# Altium project 400W_Multiinput_Converter.PrjPCB
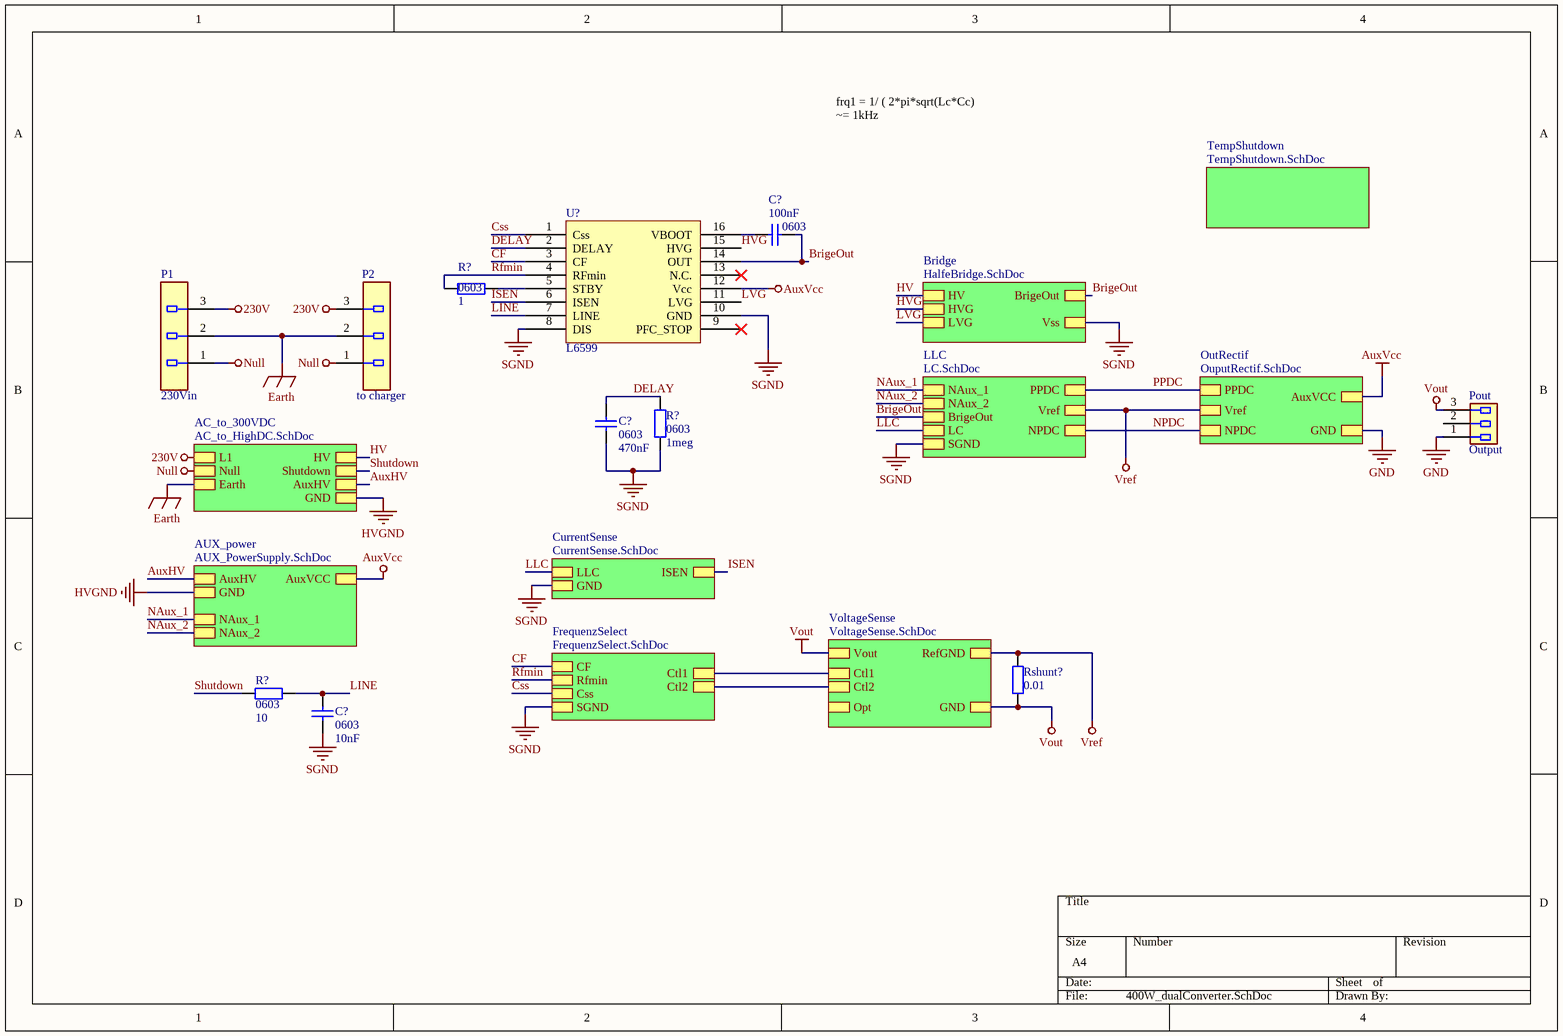
[diagram p0: 400W_dualConverter.SchDoc]
9 sheets, 95 parts. Net scope: hierarchical (ports join the sheet entries above them; power ports are global).
Sheets:
  400W_dualConverter.SchDoc
    AC_to_300VDC = AC_to_HighDC.SchDoc
    AUX_power = AUX_PowerSupply.SchDoc
    CurrentSense = CurrentSense.SchDoc
    OutRectif = OuputRectif.SchDoc
    TempShutdown = TempShutdown.SchDoc
    FrequenzSelect = FrequenzSelect.SchDoc
    VoltageSense = VoltageSense.SchDoc
    LLC = LC.SchDoc

## Sheet 400W_dualConverter.SchDoc
size A4

### Parts
(Parts that share a designator on the sheet are numbered #1, #2 ... from top to bottom, then left to right.)
C?#1  0603  value 100nF  [1608[0603]]
C?#2  0603  value 470nF  [1608[0603]]
C?#3  0603  value 10nF  [1608[0603]]
P1  230Vin  [IEC C14]
P2  to charger  [IEC C13 FM]
Pout  Output  [3pin, 5.08 terminal connector]
R?#1  0603  value 1  [1608[0603]]
R?#2  0603  value 1meg  [1608[0603]]
R?#3  0603  value 10  [1608[0603]]
Rshunt?  value 0.01  [1608[0603]]  (hidden comment: Res2)
U?#1  L6599  [SOP127P600X175-16N]

### Sub-sheets
AC_to_300VDC = AC_to_HighDC.SchDoc: L1, Null, Shutdown, HV, Earth, AuxHV, GND
AUX_power = AUX_PowerSupply.SchDoc: AuxHV, GND, NAux_1, NAux_2, AuxVCC
Bridge = HalfeBridge.SchDoc (file not in this document): HV, HVG, LVG, Vss, BrigeOut
CurrentSense = CurrentSense.SchDoc: LLC, GND, ISEN
FrequenzSelect = FrequenzSelect.SchDoc: CF, Rfmin, SGND, Ctl1, Ctl2, Css
LLC = LC.SchDoc: BrigeOut, LC, SGND, PPDC, NPDC, Vref, NAux_1, NAux_2
OutRectif = OuputRectif.SchDoc: PPDC, NPDC, Vref, AuxVCC, GND
TempShutdown = TempShutdown.SchDoc: no entries
VoltageSense = VoltageSense.SchDoc: GND, RefGND, Opt, Ctl2, Ctl1, Vout

### Nets
230V: P1.3 P2.3 ; sheet AC_to_300VDC/L1  [project net L1]
AuxVcc: U?#1.12(Vcc) ; sheet AUX_power/AuxVCC, sheet OutRectif/AuxVCC
Earth: P1.2 P2.2 ; sheet AC_to_300VDC/Earth
GND: Pout.1 ; sheet OutRectif/GND
NAux_2: sheet AC_to_300VDC/GND, sheet AUX_power/GND, sheet AUX_power/NAux_2, sheet LLC/NAux_2  [also labelled HVGND]
Null: P1.1 P2.1 ; sheet AC_to_300VDC/Null
SGND: C?#2.1 C?#3.1 R?#2.2 U?#1.8(DIS) U?#1.10(GND) ; sheet CurrentSense/GND, sheet FrequenzSelect/SGND, sheet FrequenzSelect/Ctl2, sheet VoltageSense/Ctl2, sheet LLC/SGND, sheet Bridge/Vss
Vout: Pout.3 Rshunt?.1 ; sheet VoltageSense/GND, sheet VoltageSense/Vout
Vref: Rshunt?.2 ; sheet OutRectif/Vref, sheet VoltageSense/RefGND, sheet LLC/Vref
AuxHV: sheet AC_to_300VDC/AuxHV, sheet AUX_power/AuxHV
BrigeOut: C?#1.2 U?#1.14(OUT) ; sheet LLC/BrigeOut, sheet Bridge/BrigeOut
CF: U?#1.3(CF) ; sheet FrequenzSelect/CF
Css: U?#1.1(Css) ; sheet FrequenzSelect/Css
DELAY: C?#2.2 R?#2.1 U?#1.2(DELAY)
HV: sheet AC_to_300VDC/HV, sheet Bridge/HV
HVG: U?#1.15(HVG) ; sheet Bridge/HVG
ISEN: U?#1.6(ISEN) ; sheet CurrentSense/ISEN
LINE: C?#3.2 R?#3.1 U?#1.7(LINE)
LLC: sheet CurrentSense/LLC, sheet LLC/LC
LVG: U?#1.11(LVG) ; sheet Bridge/LVG
NAux_1: sheet AUX_power/NAux_1, sheet LLC/NAux_1
NPDC: sheet OutRectif/NPDC, sheet LLC/NPDC
PPDC: sheet OutRectif/PPDC, sheet LLC/PPDC
Rfmin: R?#1.2 U?#1.4(RFmin) ; sheet FrequenzSelect/Rfmin
Shutdown: R?#3.2 ; sheet AC_to_300VDC/Shutdown
NetC?#1_1: C?#1.1 U?#1.16(VBOOT)
NetR?#1_1: R?#1.1 U?#1.5(STBY)
NetR?#19_2: sheet FrequenzSelect/Ctl1, sheet VoltageSense/Ctl1

Not connected (* = marked no-connect by the designer): Pout 2; U?#1 9(PFC_STOP)* 13(N.C.)*

### Notes on the sheet
- frq1 = 1/ ( 2*pi*sqrt(Lc*Cc)
  ~= 1kHz

### Library data of the parts
C?#1-C?#3 = Cap: Capacitor; Published: 8-Jun-2000; LatestRevisionDate: 17-Jul-2002; LatestRevisionNote: Re-released for DXP Platform.; PackageReference: RAD-0.3; Publisher: Altium Limited; PackageDescription: Radial Cap, Thru-Hole; 2 Leads; 0.3 in Pin Spacing; Supplier 1: Digi-Key; Supplier Part Number 1: ECQ-U2A224KL-ND
P1 P2 = IEC C14 - Male
Pout = 3pin header
R?#1-R?#3 = Res2: Resistor; Published: 8-Jun-2000; LatestRevisionDate: 17-Jul-2002; LatestRevisionNote: Re-released for DXP Platform.; PackageReference: AXIAL-0.4; Publisher: Altium Limited; PackageDescription: Axial Device, Thru-Hole; 2 Leads; 0.4 in Pin Spacing; Supplier 1: Digi-Key; Supplier Part Number 1: 541-220KFDKR-ND
Rshunt? = Res2: PMR03EZPFU10L0; Published: 8-Jun-2000; LatestRevisionDate: 17-Jul-2002; LatestRevisionNote: Re-released for DXP Platform.; PackageReference: AXIAL-0.4; Publisher: Altium Limited; PackageDescription: Axial Device, Thru-Hole; 2 Leads; 0.4 in Pin Spacing; Supplier 1: Mouser; Supplier Part Number 1: 755-PMR03EZPFU10L0

## Sheet AC_to_HighDC.SchDoc
size A4
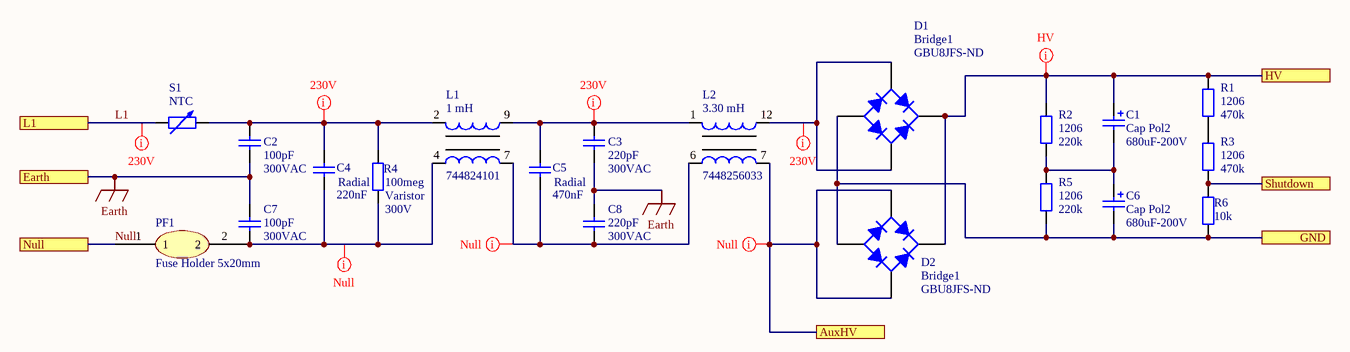
[diagram p1: AC_to_HighDC.SchDoc]

### Parts
(Parts that share a designator on the sheet are numbered #1, #2 ... from top to bottom, then left to right.)
C1  Cap Pol2  value 680uF-200V  [Capacitor]
C2  value 100pF  MaxVoltage: 300VAC  [Film Capacitor]  (hidden comment: Cap)
C3  value 220pF  MaxVoltage: 300VAC  [Film Capacitor]  (hidden comment: Cap)
C4  value 220nF  Style: Radial  [Film Capacitor]  (hidden comment: Cap)
C5  value 470nF  Style: Radial  [Film Capacitor]  (hidden comment: Cap)
C6  Cap Pol2  value 680uF-200V  [Capacitor]
C7  value 100pF  MaxVoltage: 300VAC  [Film Capacitor]  (hidden comment: Cap)
C8  value 220pF  MaxVoltage: 300VAC  [Film Capacitor]  (hidden comment: Cap)
D1#1  Bridge1  Supplier Part Number 1: GBU8JFS-ND  [BridgeRectif]
D2#1  Bridge1  Supplier Part Number 1: GBU8JFS-ND  [BridgeRectif]
L1  744824101  Inductance: 1 mH  [WE-CMB-L]
L2  7448256033  Inductance: 3.30 mH  [WE-CMB-XL]
PF1  Fuse Holder 5x20mm  [FuseHolder]
R1  1206  value 470k  [C1206]
R2  1206  value 220k  [C1206]
R3  1206  value 470k  [C1206]
R4  300V  value 100meg  [Varistor]
R5  1206  value 220k  [C1206]
R6  value 10k  [6-0805_N]  (hidden comment: Res2)
S1  NTC  [NTC]

### Ports
AuxHV, Earth, GND, HV, L1, Null, Shutdown

### Nets
Earth: C2.1 C3.1 C7.2 C8.2 ; port Earth
L1: S1.1 ; port L1
NAux_2: C6.2 D1#1.4(A) D2#1.4(A) R5.1 R6.1 ; port GND
Null: PF1.1 ; port Null
AuxHV: D2#1.2(C) D2#1.3(C) L2.7 ; port AuxHV
HV: C1.1 D1#1.1(K) D2#1.1(K) R1.2 R2.2 ; port HV
Shutdown: R3.1 R6.2 ; port Shutdown
NetC1_2: C1.2 C6.1 R2.1 R5.2
NetC2_2: C2.2 C4.2 L1.2 R4.2 S1.2
NetC3_2: C3.2 C5.2 L1.9 L2.1
NetC4_1: C4.1 C7.1 L1.4 PF1.2 R4.1
NetC5_1: C5.1 C8.1 L1.7 L2.6
NetD1#1_2: D1#1.2(C) D1#1.3(C) L2.12
NetR1_1: R1.1 R3.2

### Layout directives
mark named 230V: L1, NetC2_2, NetC3_2, NetD1#1_2
mark named Null: AuxHV, NetC4_1, NetC5_1
mark named HV: HV

### Library data of the parts
C1 C6 = Cap Pol2: Polarized Capacitor (Axial); Published: 8-Jun-2000; LatestRevisionDate: 17-Jul-2002; LatestRevisionNote: Re-released for DXP Platform.; PackageReference: POLAR0.8; Publisher: Altium Limited; PackageDescription: Polarized Capacitor; 2 Leads; Supplier 1: Digi-Key; Supplier Part Number 1: 493-2703-ND
C2-C5 C7 C8 = Cap: Capacitor; Published: 8-Jun-2000; LatestRevisionDate: 17-Jul-2002; LatestRevisionNote: Re-released for DXP Platform.; PackageReference: RAD-0.3; Publisher: Altium Limited; PackageDescription: Radial Cap, Thru-Hole; 2 Leads; 0.3 in Pin Spacing; Supplier 1: Digi-Key
  C2 C3 C7 C8: Supplier Part Number 1: 490-9469-ND
  C4 C5: Supplier Part Number 1: ECQ-U2A224KL-ND
D1#1 D2#1 = Bridge1: Full Wave Diode Bridge; Published: 8-Jun-2000; LatestRevisionDate: 29-May-2009; LatestRevisionNote: Sch pins A & K swapped.; DatasheetVersion: E2732B; PackageReference: D-38; Publisher: Altium Limited; PackageDescription: Bridge Rectifier; 4 Terminals; Body 9.4 x 9.4 mm (typ); Pitch 5.08 mm; Supplier 1: Digi-Key
L1 = 744824101: THT Common Mode Power Line Choke WE-CMB, L = 1.00 mH; ComponentLink1Description: Manufacturer Link; ComponentLink2Description: Datasheet; DatasheetVersion: ver 5, Oct-2004; ComponentLink1URL: http://www.we-online.com; PackageVersion: 2004; PackageDescription: THT Inductor, 4-Leads, Body 27.5 x 18.5 mm; ComponentLink2URL: http://www.we-online.de/katalog/media/pdf/744824101.pdf; PackageReference: WE-CMB-L; PartNumber: 744824101; Supplier 1: Mouser; Supplier Part Number 1: 710-744824101
L2 = 7448256033: THT Common Mode Power Line Choke WE-CMB, L = 3.30 mH; ComponentLink1Description: Manufacturer Link; ComponentLink2Description: Datasheet; DatasheetVersion: ver 4, Oct-2004; ComponentLink1URL: http://www.we-online.com; PackageVersion: 2004; PackageDescription: THT Inductor, 4-Leads, Body 30.0 x 21.0 mm; ComponentLink2URL: http://www.we-online.de/katalog/media/pdf/7448256033.pdf; PackageReference: WE-CMB-XL; PartNumber: 7448256033
PF1 = Fuse Holder
R1-R6 = Res2: Resistor; Published: 8-Jun-2000; LatestRevisionDate: 17-Jul-2002; LatestRevisionNote: Re-released for DXP Platform.; PackageReference: AXIAL-0.4; Publisher: Altium Limited; PackageDescription: Axial Device, Thru-Hole; 2 Leads; 0.4 in Pin Spacing
  R1-R3 R5: Supplier 1: Digi-Key; Supplier Part Number 1: 541-220KFDKR-ND
  R4: Type: Varistor
  R6: Supplier 1: Digi-Key; Supplier Part Number 1: 490-2436-1-ND
S1 = Res Adj2: InrushProtection; Value: 2; Set Position: 0.5; Published: 8-Jun-2000; LatestRevisionDate: 17-Jul-2002; LatestRevisionNote: Re-released for DXP Platform.; PackageReference: AXIAL-0.6; Publisher: Altium Limited; PackageDescription: Axial Device, Thru-Hole; 2 Leads; 0.6 in Pin Spacing; Supplier 1: Digi-Key

## Sheet AUX_PowerSupply.SchDoc
size A4
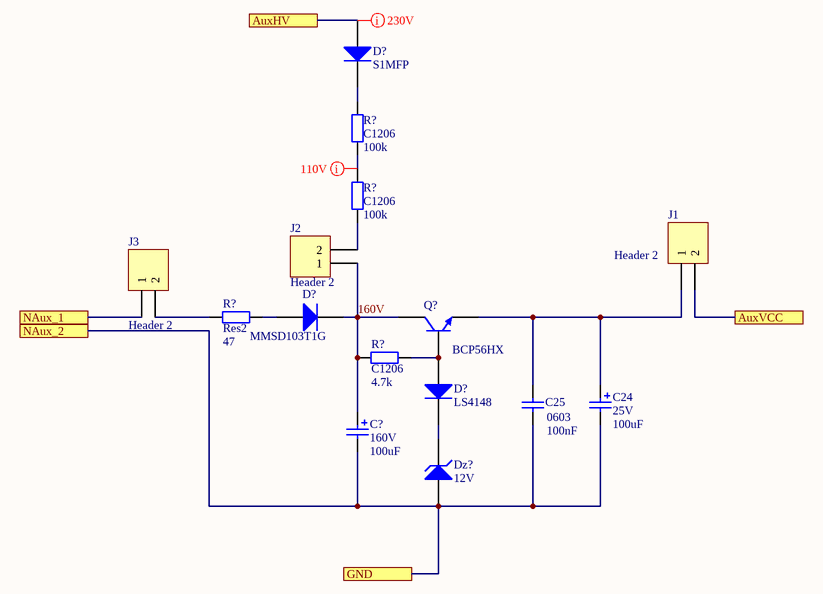
[diagram p2: AUX_PowerSupply.SchDoc]

### Parts
(Parts that share a designator on the sheet are numbered #1, #2 ... from top to bottom, then left to right.)
C24  25V  value 100uF  [100uF25V]
C25  0603  value 100nF  [1608[0603]]
C?#4  160V  value 100uF  [cap d=6.3]
D?#1  S1MFP  [MRA4007T3G]
D?#2  MMSD103T1G  [SOD-123]
D?#3  LS4148  [SOD-80]
Dz?  12V  [12V Zener]
J1  Header 2  [HDR1X2]
J2  Header 2  [HDR1X2]
J3  Header 2  [HDR1X2]
Q?#1  BCP56HX  [SOT223_M]
R?#4  C1206  value 100k  [C1206]
R?#5  C1206  value 100k  [C1206]
R?#6  Res2  value 47  [1608[0603]]
R?#7  C1206  value 4.7k  [C1206]

### Ports
AuxHV, AuxVCC, GND, NAux_1, NAux_2

### Nets
AuxVcc: J1.2 ; port AuxVCC
NAux_2: C24.2 C25.1 C?#4.2 Dz?.1(A) ; port NAux_2, port GND
160V: C?#4.1 D?#2.2(K) J2.1 Q?#1.2(C) R?#7.2
AuxHV: D?#1.1(A) ; port AuxHV
NAux_1: J3.1 ; port NAux_1
NetC24_1: C24.1 C25.2 J1.1 Q?#1.3(E)
NetD?#1_2: D?#1.2(K) R?#4.2
NetD?#2_1: D?#2.1(A) R?#6.1
NetD?#3_1: D?#3.1(A) Q?#1.1(B) R?#7.1
NetD?#3_2: D?#3.2(K) Dz?.2(K)
NetJ2_2: J2.2 R?#5.1
NetJ3_2: J3.2 R?#6.2
NetR?#4_1: R?#4.1 R?#5.2

### Layout directives
mark named 230V: AuxHV
mark named 110V: NetR?#4_1

### Library data of the parts
C24 C?#4 = Cap Pol2: Polarized Capacitor (Axial); Published: 8-Jun-2000; LatestRevisionDate: 17-Jul-2002; LatestRevisionNote: Re-released for DXP Platform.; PackageReference: POLAR0.8; Publisher: Altium Limited; PackageDescription: Polarized Capacitor; 2 Leads; Supplier 1: Digi-Key; Supplier Part Number 1: 493-2703-ND
C25 = Cap: Capacitor; Published: 8-Jun-2000; LatestRevisionDate: 17-Jul-2002; LatestRevisionNote: Re-released for DXP Platform.; PackageReference: RAD-0.3; Publisher: Altium Limited; PackageDescription: Radial Cap, Thru-Hole; 2 Leads; 0.3 in Pin Spacing; Supplier 1: Digi-Key; Supplier Part Number 1: 478-1138-6-ND
D?#1-D?#3 = Diode: Default Diode; Published: 8-Jun-2000; LatestRevisionDate: 17-Jul-2002; LatestRevisionNote: Re-released for DXP Platform.; PackageVersion: Sep-1996; PackageReference: SMC; Publisher: Altium Limited; PackageDescription: DO-214-AB/SMC; 2 C-Bend Leads; Body 7.9 x 5.9 mm, inc. leads (LxW); Code_JEDEC: DO-214-AB
  D?#1: Supplier 1: Mouser; Supplier Part Number 1: 863-MRA4007T3G
  D?#2: Supplier 1: Mouser; Supplier Part Number 1: 863-MMSD103T1G
Dz? = D Zener: Zener Diode; Published: 8-Jun-2000; LatestRevisionDate: 17-Jul-2002; LatestRevisionNote: Re-released for DXP Platform.; PackageReference: DIODE-0.7; Publisher: Altium Limited; PackageDescription: Diode, Thru-Hole; 2 Leads; 0.7 in Pin Spacing
J1-J3 = Header 2: Header, 2-Pin; LatestRevisionDate: 17-Jul-2002; LatestRevisionNote: Re-released for DXP Platform.; Publisher: Altium Limited
Q?#1 = 2N3904: NPN General Purpose Amplifier; Published: 8-Jun-2000; LatestRevisionDate: 15-Jan-2003; LatestRevisionNote: PCB Footprint 'BCY-W3/D4.7' replaced; DatasheetVersion: 1997; PackageVersion: Sep-1998; PackageReference: TO-92A; Publisher: Altium Limited; PackageDescription: TO, Flat Index; 3 In-Line, Axial Leads; Body Dia. 4.5mm; Leads 0.51 x 0.48 mm (max); ComponentLink1Description: Manufacturer Link; ComponentLink1URL: http://www.fairchildsemi.com/; ComponentLink2Description: Datasheet; ComponentLink2URL: http://www.fairchildsemi.com/ds/2N%2F2N3904.pdf; Supplier 1: Arrow Electronics, Inc.; Supplier Part Number 1: BCP55-16F
R?#4-R?#7 = Res2: Resistor; Published: 8-Jun-2000; LatestRevisionDate: 17-Jul-2002; LatestRevisionNote: Re-released for DXP Platform.; PackageReference: AXIAL-0.4; Publisher: Altium Limited; PackageDescription: Axial Device, Thru-Hole; 2 Leads; 0.4 in Pin Spacing; Supplier 1: Digi-Key; Supplier Part Number 1: 541-220KFDKR-ND

## Sheet CurrentSense.SchDoc
size A4
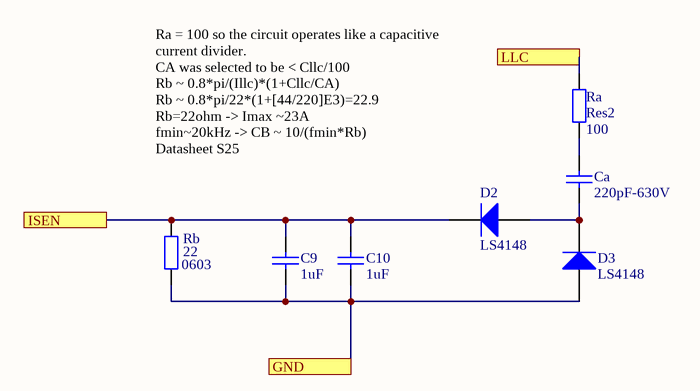
[diagram p3: CurrentSense.SchDoc]

### Parts
(Parts that share a designator on the sheet are numbered #1, #2 ... from top to bottom, then left to right.)
C9  value 1uF  [1608[0603]]  (hidden comment: Cap)
C10  value 1uF  [1608[0603]]  (hidden comment: Cap)
Ca  value 220pF-630V  [1812]  (hidden comment: Cap)
D2#2  LS4148  [SOD-80]
D3  LS4148  [SOD-80]
Ra  Res2  value 100  [C1206]
Rb  0603  value 22  [1608[0603]]

### Ports
GND, ISEN, LLC

### Nets
SGND: C9.1 C10.1 D3.1(A) Rb.1 ; port GND
ISEN: C9.2 C10.2 D2#2.2(K) Rb.2 ; port ISEN
LLC: Ra.2 ; port LLC
NetCa_1: Ca.1 D2#2.1(A) D3.2(K)
NetCa_2: Ca.2 Ra.1

### Notes on the sheet
- Ra = 100 so the circuit operates like a capacitive current divider.
  CA was selected to be < Cllc/100
  Rb ~ 0.8*pi/(Illc)*(1+Cllc/CA)
  Rb ~ 0.8*pi/22*(1+[44/220]E3)=22.9
  Rb=22ohm -> Imax ~23A
  fmin~20kHz -> CB ~ 10/(fmin*Rb)
  Datasheet S25

### Library data of the parts
C9 C10 Ca = Cap: Capacitor; Published: 8-Jun-2000; LatestRevisionDate: 17-Jul-2002; LatestRevisionNote: Re-released for DXP Platform.; PackageReference: RAD-0.3; Publisher: Altium Limited; PackageDescription: Radial Cap, Thru-Hole; 2 Leads; 0.3 in Pin Spacing
  C9 C10: Supplier 1: Mouser; Supplier Part Number 1: 710-885012106017
  Ca: Supplier 1: Digi-Key; Supplier Part Number 1: 478-1138-6-ND
D2#2 D3 = Diode: Default Diode; Published: 8-Jun-2000; LatestRevisionDate: 17-Jul-2002; LatestRevisionNote: Re-released for DXP Platform.; PackageVersion: Sep-1996; PackageReference: SMC; Publisher: Altium Limited; PackageDescription: DO-214-AB/SMC; 2 C-Bend Leads; Body 7.9 x 5.9 mm, inc. leads (LxW); Code_JEDEC: DO-214-AB
Ra Rb = Res2: Resistor; Published: 8-Jun-2000; LatestRevisionDate: 17-Jul-2002; LatestRevisionNote: Re-released for DXP Platform.; PackageReference: AXIAL-0.4; Publisher: Altium Limited; PackageDescription: Axial Device, Thru-Hole; 2 Leads; 0.4 in Pin Spacing; Supplier 1: Digi-Key; Supplier Part Number 1: 541-220KFDKR-ND

## Sheet OuputRectif.SchDoc
size A4
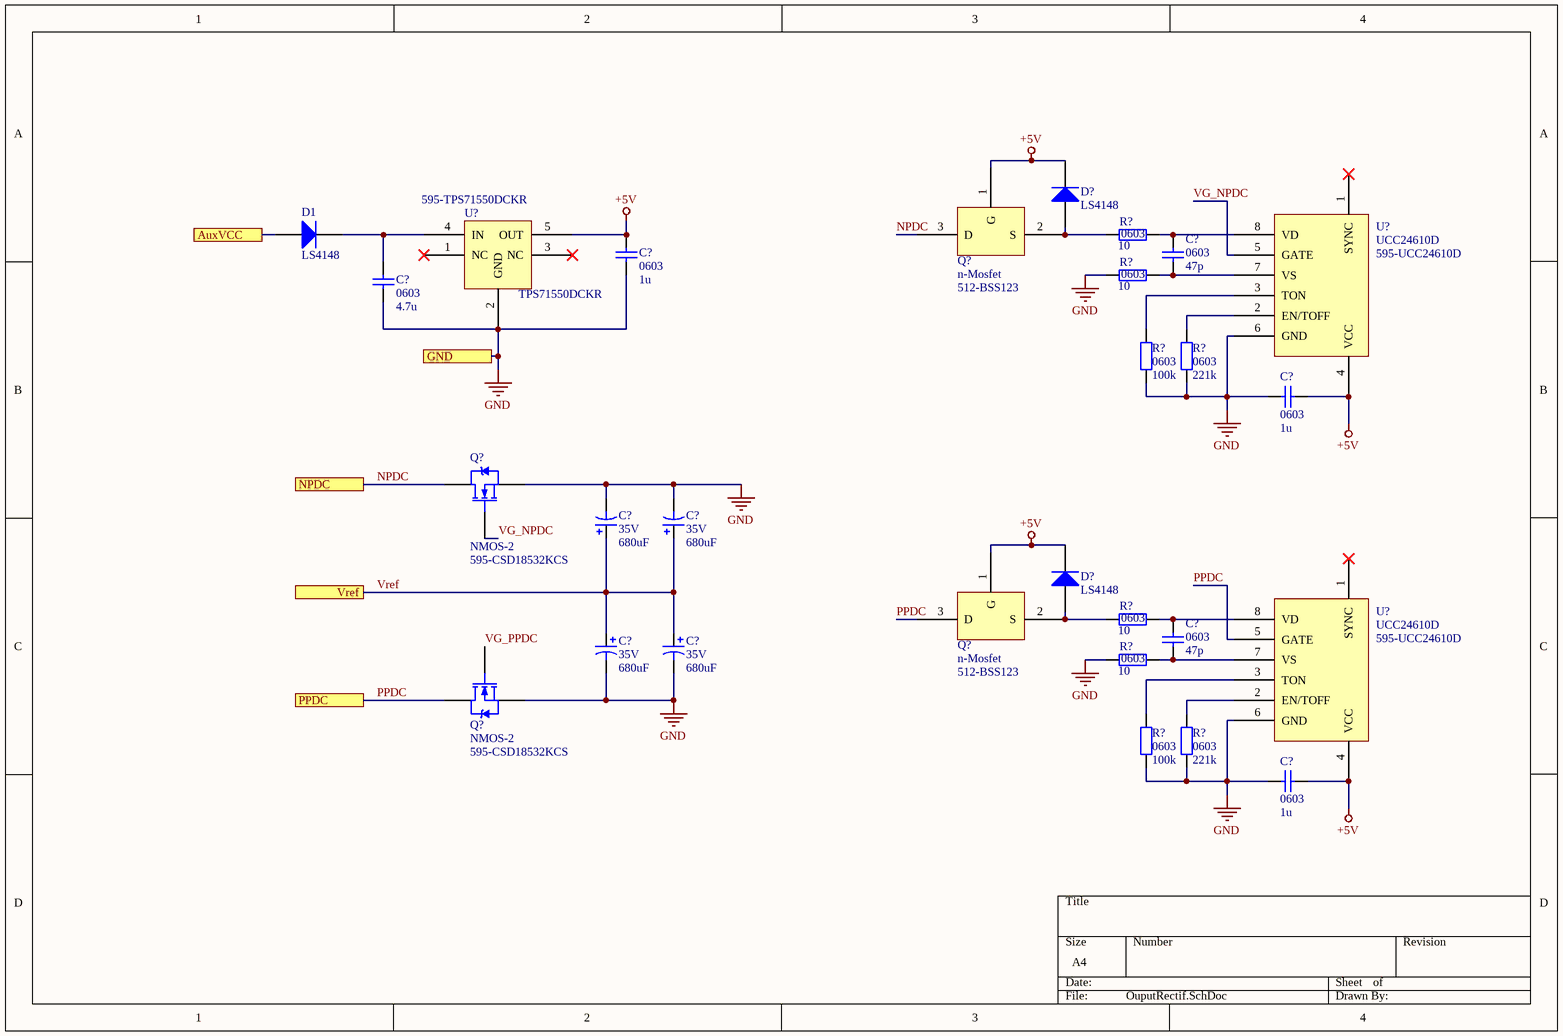
[diagram p4: OuputRectif.SchDoc]

### Parts
(Parts that share a designator on the sheet are numbered #1, #2 ... from top to bottom, then left to right.)
C?#5  0603  value 1u  [1608[0603]]
C?#6  0603  value 47p  [1608[0603]]
C?#7  0603  value 4.7u  [1608[0603]]
C?#8  0603  value 1u  [1608[0603]]
C?#9  35V  value 680uF  [RB7.6-15]
C?#10  35V  value 680uF  [RB7.6-15]
C?#11  0603  value 47p  [1608[0603]]
C?#12  35V  value 680uF  [RB7.6-15]
C?#13  35V  value 680uF  [RB7.6-15]
C?#14  0603  value 1u  [1608[0603]]
D1#2  LS4148  [SOD-80]
D?#4  LS4148  [SOD-80]
D?#5  LS4148  [SOD-80]
Q?#2  n-Mosfet  Supplier Part Number 1: 512-BSS123  [BSS123]
Q?#3  NMOS-2  Supplier Part Number 1: 595-CSD18532KCS  [TO-220AB]
Q?#4  n-Mosfet  Supplier Part Number 1: 512-BSS123  [BSS123]
Q?#5  NMOS-2  Supplier Part Number 1: 595-CSD18532KCS  [TO-220AB]
R?#8  0603  value 10  [1608[0603]]
R?#9  0603  value 10  [1608[0603]]
R?#10  0603  value 221k  [1608[0603]]
R?#11  0603  value 100k  [1608[0603]]
R?#12  0603  value 10  [1608[0603]]
R?#13  0603  value 10  [1608[0603]]
R?#14  0603  value 221k  [1608[0603]]
R?#15  0603  value 100k  [1608[0603]]
U?#2  TPS71550DCKR  Supplier Part Number 1: 595-TPS71550DCKR  [TPS71550DCKR]
U?#3  UCC24610D  Supplier Part Number 1: 595-UCC24610D  [UCC24610D]
U?#4  UCC24610D  Supplier Part Number 1: 595-UCC24610D  [UCC24610D]

### Ports
AuxVCC, GND, NPDC, PPDC, Vref

### Nets
+5V: C?#5.1 C?#8.1 C?#14.1 D?#4.2(K) D?#5.2(K) Q?#2.1(G) Q?#4.1(G) U?#2.5(OUT) U?#3.4(VCC) U?#4.4(VCC)
AuxVcc: D1#2.1(A) ; port AuxVCC
GND: C?#5.2 C?#7.2 C?#8.2 C?#9.2 C?#10.2 C?#12.2 C?#13.2 C?#14.2 Q?#3.3(S) Q?#5.3(S) R?#9.1 R?#10.2 R?#11.1 R?#13.1 R?#14.2 R?#15.1 U?#2.2(GND) U?#3.6(GND) U?#4.6(GND) ; port GND
Vref: C?#9.1 C?#10.1 C?#12.1 C?#13.1 ; port Vref
NPDC: Q?#2.3(D) Q?#3.2(D) ; port NPDC
PPDC: Q?#4.3(D) Q?#5.2(D) U?#4.5(GATE) ; port PPDC
VG_NPDC: Q?#3.1(G) U?#3.5(GATE)
VG_PPDC: Q?#5.1(G)
NetC?#6_1: C?#6.1 R?#8.2 U?#3.8(VD)
NetC?#6_2: C?#6.2 R?#9.2 U?#3.7(VS)
NetC?#7_1: C?#7.1 D1#2.2(K) U?#2.4(IN)
NetC?#11_1: C?#11.1 R?#12.2 U?#4.8(VD)
NetC?#11_2: C?#11.2 R?#13.2 U?#4.7(VS)
NetD?#4_1: D?#4.1(A) Q?#2.2(S) R?#8.1
NetD?#5_1: D?#5.1(A) Q?#4.2(S) R?#12.1
NetR?#10_1: R?#10.1 U?#3.2(EN/TOFF)
NetR?#11_2: R?#11.2 U?#3.3(TON)
NetR?#14_1: R?#14.1 U?#4.2(EN/TOFF)
NetR?#15_2: R?#15.2 U?#4.3(TON)

Not connected (* = marked no-connect by the designer): U?#2 1(NC)* 3(NC)*; U?#3 1(SYNC)*; U?#4 1(SYNC)*

### Library data of the parts
C?#5-C?#8 C?#11 C?#14 = Cap: Capacitor; Published: 8-Jun-2000; LatestRevisionDate: 17-Jul-2002; LatestRevisionNote: Re-released for DXP Platform.; PackageReference: RAD-0.3; Publisher: Altium Limited; PackageDescription: Radial Cap, Thru-Hole; 2 Leads; 0.3 in Pin Spacing; Supplier 1: Digi-Key; Supplier Part Number 1: ECQ-U2A224KL-ND
C?#9 C?#10 C?#12 C?#13 = Cap Pol1: Polarized Capacitor (Radial); Published: 8-Jun-2000; LatestRevisionDate: 17-Jul-2002; LatestRevisionNote: Re-released for DXP Platform.; PackageReference: RB7.6-15; Publisher: Altium Limited; PackageDescription: Polarized Capacitor (Radial); 2 Leads
D1#2 D?#4 D?#5 = Diode: Default Diode; Published: 8-Jun-2000; LatestRevisionDate: 17-Jul-2002; LatestRevisionNote: Re-released for DXP Platform.; PackageVersion: Sep-1996; PackageReference: SMC; Publisher: Altium Limited; PackageDescription: DO-214-AB/SMC; 2 C-Bend Leads; Body 7.9 x 5.9 mm, inc. leads (LxW); Code_JEDEC: DO-214-AB
Q?#2 Q?#4 = BSS123: Supplier 1: Mouser
Q?#3 Q?#5 = NMOS-2: N-Channel Power MOSFET; Note: Pin 2 is electrically connected to pin 4.; Published: 8-Jun-2000; LatestRevisionDate: 17-Jul-2002; LatestRevisionNote: Re-released for DXP Platform.; DatasheetVersion: PD-9.814; PackageVersion: Feb-1997; PackageReference: TO-220AB; Publisher: Altium Limited; PackageDescription: TO, Thru-Hole, Vertical, Heatsink Mounted; 3 In-Line Leads; Pitch 2.54 mm; ComponentLink1Description: Manufacturer Link; ComponentLink1URL: http://www.irf.com/; Supplier 1: Mouser
R?#8-R?#15 = Res2: Resistor; Published: 8-Jun-2000; LatestRevisionDate: 17-Jul-2002; LatestRevisionNote: Re-released for DXP Platform.; PackageReference: AXIAL-0.4; Publisher: Altium Limited; PackageDescription: Axial Device, Thru-Hole; 2 Leads; 0.4 in Pin Spacing; Supplier 1: Digi-Key; Supplier Part Number 1: 541-220KFDKR-ND
U?#2 = TPS71550DCKR: Supplier 1: Mouser
U?#3 U?#4 = UCC24610D: Supplier 1: Mouser

## Sheet TempShutdown.SchDoc
size A4

## Sheet FrequenzSelect.SchDoc
size A4
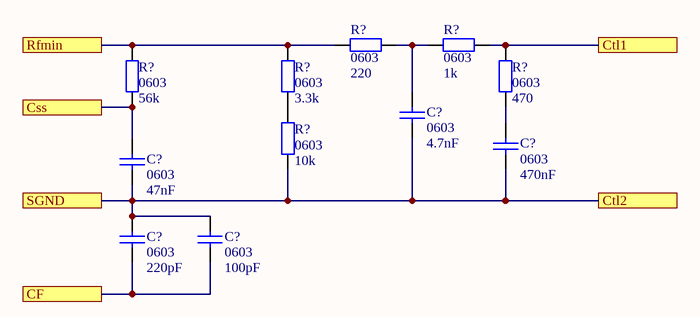
[diagram p5: FrequenzSelect.SchDoc]

### Parts
(Parts that share a designator on the sheet are numbered #1, #2 ... from top to bottom, then left to right.)
C?#15  0603  value 4.7nF  [1608[0603]]
C?#16  0603  value 470nF  [1608[0603]]
C?#17  0603  value 47nF  [1608[0603]]
C?#18  0603  value 220pF  [1608[0603]]
C?#19  0603  value 100pF  [1608[0603]]
R?#16  0603  value 56k  [1608[0603]]
R?#17  0603  value 3.3k  [1608[0603]]
R?#18  0603  value 220  [1608[0603]]
R?#19  0603  value 1k  [1608[0603]]
R?#20  0603  value 470  [1608[0603]]
R?#21  0603  value 10k  [1608[0603]]

### Ports
CF, Css, Ctl1, Ctl2, Rfmin, SGND

### Nets
SGND: C?#15.1 C?#16.1 C?#17.1 C?#18.2 C?#19.2 R?#21.2 ; port Ctl2, port SGND
CF: C?#18.1 C?#19.1 ; port CF
Css: C?#17.2 R?#16.2 ; port Css
Rfmin: R?#16.1 R?#17.1 R?#18.1 ; port Rfmin
NetC?#15_2: C?#15.2 R?#18.2 R?#19.1
NetC?#16_2: C?#16.2 R?#20.1
NetR?#17_2: R?#17.2 R?#21.1
NetR?#19_2: R?#19.2 R?#20.2 ; port Ctl1

### Library data of the parts
C?#15-C?#19 = Cap: Capacitor; Published: 8-Jun-2000; LatestRevisionDate: 17-Jul-2002; LatestRevisionNote: Re-released for DXP Platform.; PackageReference: RAD-0.3; Publisher: Altium Limited; PackageDescription: Radial Cap, Thru-Hole; 2 Leads; 0.3 in Pin Spacing; Supplier 1: Digi-Key; Supplier Part Number 1: ECQ-U2A224KL-ND
R?#16-R?#21 = Res2: Resistor; Published: 8-Jun-2000; LatestRevisionDate: 17-Jul-2002; LatestRevisionNote: Re-released for DXP Platform.; PackageReference: AXIAL-0.4; Publisher: Altium Limited; PackageDescription: Axial Device, Thru-Hole; 2 Leads; 0.4 in Pin Spacing; Supplier 1: Digi-Key; Supplier Part Number 1: 541-220KFDKR-ND

## Sheet VoltageSense.SchDoc
size A4

## Sheet LC.SchDoc
size A4
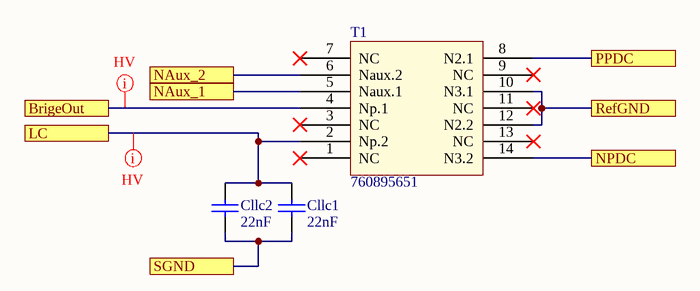
[diagram p6: LC.SchDoc]

### Parts
Cllc1  value 22nF  [1812]  (hidden comment: Cap)
Cllc2  value 22nF  [1812]  (hidden comment: Cap)
T1  760895651  [Transformer]

### Ports
BrigeOut, LC, NAux_1, NAux_2, NPDC, PPDC, RefGND, SGND

### Nets
NAux_2: T1.6(Naux.2) ; port NAux_2
SGND: Cllc1.1 Cllc2.1 ; port SGND
BrigeOut: T1.4(Np.1) ; port BrigeOut
LLC: Cllc1.2 Cllc2.2 T1.2(Np.2) ; port LC
NAux_1: T1.5(Naux.1) ; port NAux_1
NPDC: T1.14(N3.2) ; port NPDC
PPDC: T1.8(N2.1) ; port PPDC
NetT1_10: T1.10(N3.1) T1.12(N2.2) ; port RefGND

Not connected (* = marked no-connect by the designer): T1 1(NC)* 3(NC)* 7(NC)* 9(NC)* 11(NC)* 13(NC)*

### Layout directives
mark named HV: BrigeOut, LLC

### Library data of the parts
Cllc1 Cllc2 = Cap: Capacitor; Published: 8-Jun-2000; LatestRevisionDate: 17-Jul-2002; LatestRevisionNote: Re-released for DXP Platform.; PackageReference: RAD-0.3; Publisher: Altium Limited; PackageDescription: Radial Cap, Thru-Hole; 2 Leads; 0.3 in Pin Spacing; Supplier 1: Digi-Key; Supplier Part Number 1: 478-1138-6-ND
T1 = transformer: ComponentLink1Description: RS-Components; ComponentLink1URL: https://uk.rs-online.com/web/p/switch-mode-power-supply-smps-transformers/8235443/

## Nets that join several sheets
AuxVcc: 400W_dualConverter (U?#1.12), AUX_PowerSupply (J1.2), OuputRectif (D1#2.1)
Earth: 400W_dualConverter (P1.2 P2.2), AC_to_HighDC (C2.1 C3.1 C7.2 C8.2)
GND: 400W_dualConverter (Pout.1), OuputRectif (19 pins)
L1: 400W_dualConverter (P1.3 P2.3), AC_to_HighDC (S1.1)
NAux_2: AC_to_HighDC (5 pins), AUX_PowerSupply (C24.2 C25.1 C?#4.2 Dz?.1), LC (T1.6)
Null: 400W_dualConverter (P1.1 P2.1), AC_to_HighDC (PF1.1)
SGND: 400W_dualConverter (5 pins), CurrentSense (C9.1 C10.1 D3.1 Rb.1), FrequenzSelect (6 pins), LC (Cllc1.1 Cllc2.1)
Vref: 400W_dualConverter (Rshunt?.2), OuputRectif (C?#9.1 C?#10.1 C?#12.1 C?#13.1)
AuxHV: AC_to_HighDC (D2#1.2 D2#1.3 L2.7), AUX_PowerSupply (D?#1.1)
BrigeOut: 400W_dualConverter (C?#1.2 U?#1.14), LC (T1.4)
CF: 400W_dualConverter (U?#1.3), FrequenzSelect (C?#18.1 C?#19.1)
Css: 400W_dualConverter (U?#1.1), FrequenzSelect (C?#17.2 R?#16.2)
ISEN: 400W_dualConverter (U?#1.6), CurrentSense (C9.2 C10.2 D2#2.2 Rb.2)
LLC: CurrentSense (Ra.2), LC (Cllc1.2 Cllc2.2 T1.2)
NAux_1: AUX_PowerSupply (J3.1), LC (T1.5)
NPDC: OuputRectif (Q?#2.3 Q?#3.2), LC (T1.14)
PPDC: OuputRectif (Q?#4.3 Q?#5.2 U?#4.5), LC (T1.8)
Rfmin: 400W_dualConverter (R?#1.2 U?#1.4), FrequenzSelect (R?#16.1 R?#17.1 R?#18.1)
Shutdown: 400W_dualConverter (R?#3.2), AC_to_HighDC (R3.1 R6.2)